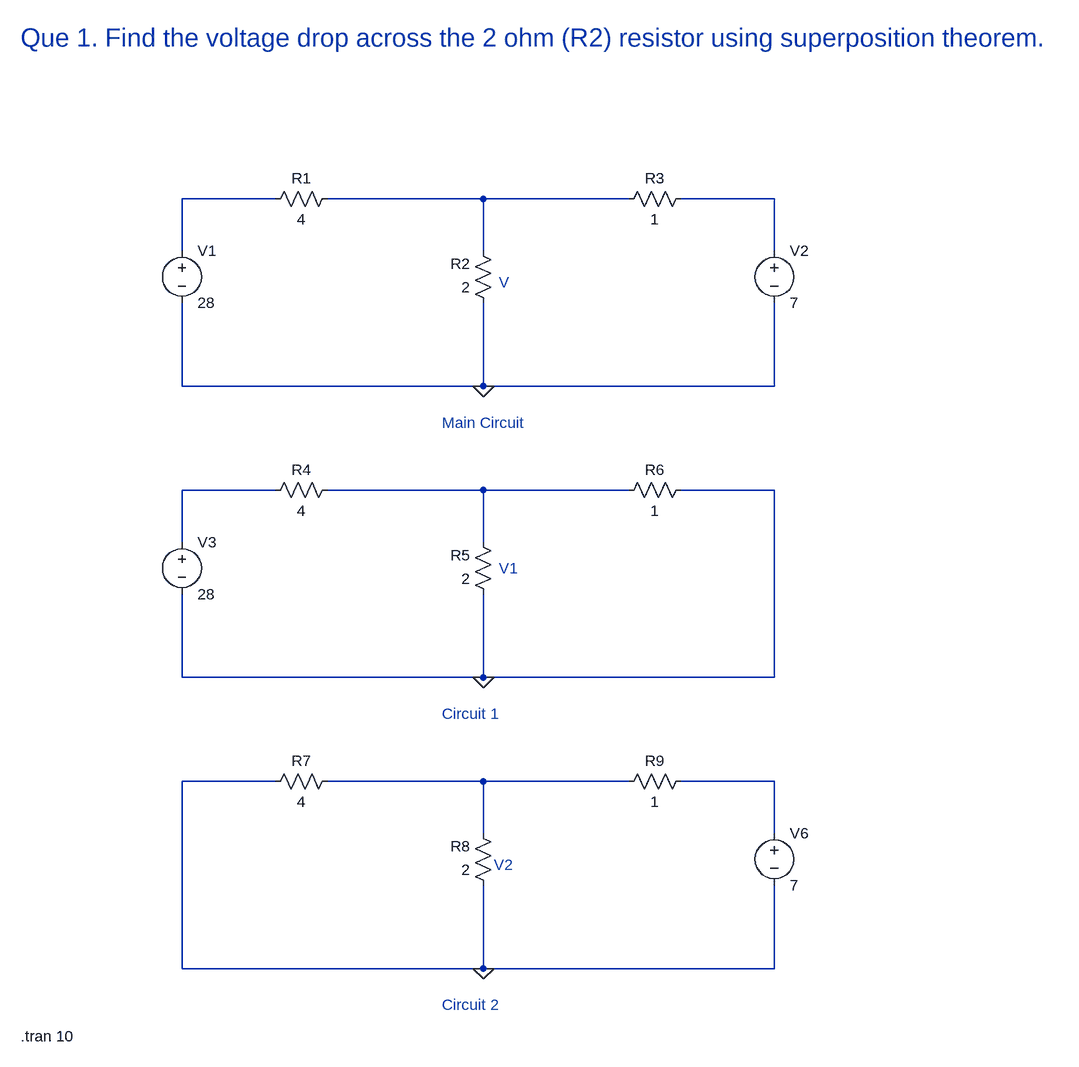
[diagram p0: schematic 1_Dheerendra_23EE019_Superposition_1.asc]
1_Dheerendra_23EE019_Superposition_1.asc, the LTspice schematic file:
Version 4
SHEET 1 880 1544
WIRE -1216 240 -1360 240
WIRE -896 240 -1136 240
WIRE -672 240 -896 240
WIRE -448 240 -592 240
WIRE -1360 320 -1360 240
WIRE -896 320 -896 240
WIRE -448 320 -448 240
WIRE -1360 528 -1360 400
WIRE -896 528 -896 400
WIRE -896 528 -1360 528
WIRE -448 528 -448 400
WIRE -448 528 -896 528
WIRE -1216 688 -1360 688
WIRE -896 688 -1136 688
WIRE -672 688 -896 688
WIRE -448 688 -592 688
WIRE -1360 768 -1360 688
WIRE -896 768 -896 688
WIRE -1360 976 -1360 848
WIRE -896 976 -896 848
WIRE -896 976 -1360 976
WIRE -448 976 -448 688
WIRE -448 976 -896 976
WIRE -1216 1136 -1360 1136
WIRE -896 1136 -1136 1136
WIRE -672 1136 -896 1136
WIRE -448 1136 -592 1136
WIRE -896 1216 -896 1136
WIRE -448 1216 -448 1136
WIRE -1360 1424 -1360 1136
WIRE -896 1424 -896 1296
WIRE -896 1424 -1360 1424
WIRE -448 1424 -448 1296
WIRE -448 1424 -896 1424
FLAG -896 528 0
FLAG -896 976 0
FLAG -896 1424 0
SYMBOL res -1120 224 R90
WINDOW 0 0 56 VBottom 2
WINDOW 3 32 56 VTop 2
SYMATTR InstName R1
SYMATTR Value 4
SYMBOL res -880 416 R180
WINDOW 0 36 76 Left 2
WINDOW 3 36 40 Left 2
SYMATTR InstName R2
SYMATTR Value 2
SYMBOL res -576 224 R90
WINDOW 0 0 56 VBottom 2
WINDOW 3 32 56 VTop 2
SYMATTR InstName R3
SYMATTR Value 1
SYMBOL voltage -1360 304 R0
WINDOW 123 0 0 Left 0
WINDOW 39 0 0 Left 0
SYMATTR InstName V1
SYMATTR Value 28
SYMBOL voltage -448 304 R0
WINDOW 123 0 0 Left 0
WINDOW 39 0 0 Left 0
SYMATTR InstName V2
SYMATTR Value 7
SYMBOL res -1120 672 R90
WINDOW 0 0 56 VBottom 2
WINDOW 3 32 56 VTop 2
SYMATTR InstName R4
SYMATTR Value 4
SYMBOL res -880 864 R180
WINDOW 0 36 76 Left 2
WINDOW 3 36 40 Left 2
SYMATTR InstName R5
SYMATTR Value 2
SYMBOL res -576 672 R90
WINDOW 0 0 56 VBottom 2
WINDOW 3 32 56 VTop 2
SYMATTR InstName R6
SYMATTR Value 1
SYMBOL voltage -1360 752 R0
WINDOW 123 0 0 Left 0
WINDOW 39 0 0 Left 0
SYMATTR InstName V3
SYMATTR Value 28
SYMBOL res -1120 1120 R90
WINDOW 0 0 56 VBottom 2
WINDOW 3 32 56 VTop 2
SYMATTR InstName R7
SYMATTR Value 4
SYMBOL res -880 1312 R180
WINDOW 0 36 76 Left 2
WINDOW 3 36 40 Left 2
SYMATTR InstName R8
SYMATTR Value 2
SYMBOL res -576 1120 R90
WINDOW 0 0 56 VBottom 2
WINDOW 3 32 56 VTop 2
SYMATTR InstName R9
SYMATTR Value 1
SYMBOL voltage -448 1200 R0
WINDOW 123 0 0 Left 0
WINDOW 39 0 0 Left 0
SYMATTR InstName V6
SYMATTR Value 7
TEXT -1608 -8 Left 4 ;Que 1. Find the voltage drop across the 2 ohm (R2) resistor using superposition theorem.
TEXT -1608 1528 Left 2 !.tran 10
TEXT -960 584 Left 2 ;Main Circuit
TEXT -960 1032 Left 2 ;Circuit 1
TEXT -960 1480 Left 2 ;Circuit 2
TEXT -872 368 Left 2 ;V
TEXT -872 808 Left 2 ;V1
TEXT -880 1264 Left 2 ;V2

The netlist it stands for:
* 1_Dheerendra_23EE019_Superposition_1.asc
R1 N002 N001 4
R2 0 N002 2
R3 N003 N002 1
V1 N001 0 28
V2 N003 0 7
R4 N005 N004 4
R5 0 N005 2
R6 0 N005 1
V3 N004 0 28
R7 N006 0 4
R8 0 N006 2
R9 N007 N006 1
V6 N007 0 7
* Que 1. Find the voltage drop across the 2 ohm (R2) resistor using superposition theorem.
.tran 10
* Main Circuit
* Circuit 1
* Circuit 2
* V
* V1
* V2
.backanno
.end